# Altium project gap9_deck_v2.PrjPcb (part 1 of 2)
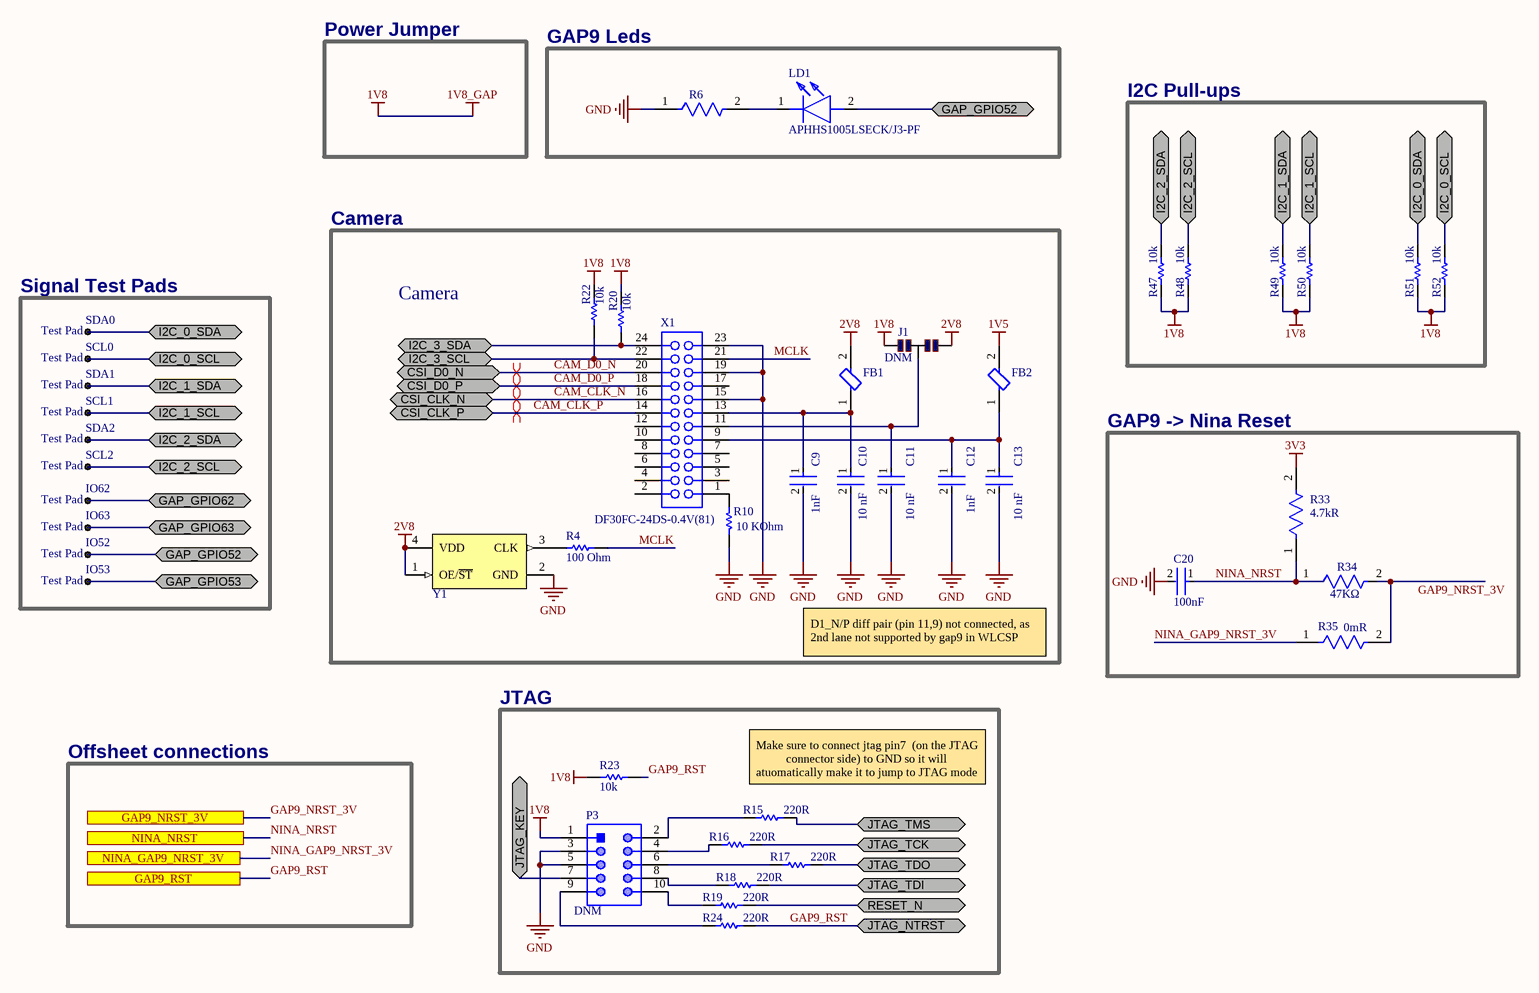
[diagram p0: 01_GAP9_INTERFACE.SchDoc]
9 sheets, 181 parts. Net scope: flat (ports and power ports of the same name join across sheets).
Board file: Crazyflie_Shield.PcbDoc
Sheets:
  01_GAP9_INTERFACE.SchDoc
  02_GAP9_CHIP_POWER.SchDoc
  03_GAP9_CHIP_JTAG_XTALs.SchDoc
  04_GAP9_CHIP_MEM.SchDoc
  05_GAP9_CHIP_GPIO.SchDoc
  06_TOFs.SchDoc
  07_NINA-WIFI.SchDoc
  08_CF_INTERFACE.SchDoc
  09_POWER.SchDoc

## Sheet 01_GAP9_INTERFACE.SchDoc: GAP9Shield
size A3; DrawnBy: Hanna Müller and Victor Kartsch; Organization: Integrated Systems Laboratory; DocumentNumber: 1; Revision: v1.0; SheetNumber: 1; SheetTotal: 9

### Parts
C9  value 1nF  [FP-GRM155-0_05-IPC_B]  (hidden comment: C0402C102F5GECAUTO)
C10  Capacitance: 10 nF  [FP-CC0402-MFG]  (hidden comment: CC0402KRX7R7BB103)
C11  Capacitance: 10 nF  [FP-CC0402-MFG]  (hidden comment: CC0402KRX7R7BB103)
C12  value 1nF  [FP-GRM155-0_05-IPC_B]  (hidden comment: C0402C102F5GECAUTO)
C13  Capacitance: 10 nF  [FP-CC0402-MFG]  (hidden comment: CC0402KRX7R7BB103)
C20  value 100nF  [FP-C1005-050-0_05-MFG]  (hidden comment: C1005X5R1E104K050BC)
FB1  BLM18HE152SN1D  [FP-BLM18-0_15-t0_8-IPC_C]  (value not drawn)
FB2  BLM18HE152SN1D  [FP-BLM18-0_15-t0_8-IPC_C]  (value not drawn)
IO52  Test Pad  [Pad-1.5mm]  (no BOM)
IO53  Test Pad  [Pad-1.5mm]  (no BOM)
IO62  Test Pad  [Pad-1.5mm]  (no BOM)
IO63  Test Pad  [Pad-1.5mm]  (no BOM)
J1  DNM  [Jumper 3 pins]  (no BOM)
LD1  APHHS1005LSECK/J3-PF  [APHHS1005LSECKJ3PF]
P3  DNM  [2x10Pin_Horizontal_50mil]
R4  value 100 Ohm  [RESC1005X40X25LL05T05]  (hidden comment: ERJ-2RKF1000X)
R6  RC0201JR-070RL  [FP-RC_L0201-MFG]  (value not drawn)
R10  value 10 KOhm  [RESC1005X40X25NL05T05]  (hidden comment: ERJ-2RKF1002X)
R15  value 220R  [RESC0603X28X15ML05T05]  (hidden comment: CRCW0201220RFKED)
R16  value 220R  [RESC0603X28X15ML05T05]  (hidden comment: CRCW0201220RFKED)
R17  value 220R  [RESC0603X28X15ML05T05]  (hidden comment: CRCW0201220RFKED)
R18  value 220R  [RESC0603X28X15ML05T05]  (hidden comment: CRCW0201220RFKED)
R19  value 220R  [RESC0603X28X15ML05T05]  (hidden comment: CRCW0201220RFKED)
R20  value 10k  [RESC0603X28X15LL05T05]  (hidden comment: CRCW020110K0FNED)
R22  value 10k  [RESC0603X28X15LL05T05]  (hidden comment: CRCW020110K0FNED)
R23  value 10k  [RESC0603X28X15LL05T05]  (hidden comment: CRCW020110K0FNED)
R24  value 220R  [RESC0603X28X15ML05T05]  (hidden comment: CRCW0201220RFKED)
R33  value 4.7kR  [FP-CRCW0402-e3-IPC_B]  (hidden comment: CRCW04024K70FKED)
R34  value 47KΩ  [FP-CRGCQ0402-IPC_C]  (hidden comment: CRGCQ0402F47K)
R35  value 0mR  [FP-CRCW0402-e3-IPC_C]  (hidden comment: CRCW04020000Z0ED)
R47  value 10k  [RESC0603X28X15LL05T05]  (hidden comment: CRCW020110K0FNED)
R48  value 10k  [RESC0603X28X15LL05T05]  (hidden comment: CRCW020110K0FNED)
R49  value 10k  [RESC0603X28X15LL05T05]  (hidden comment: CRCW020110K0FNED)
R50  value 10k  [RESC0603X28X15LL05T05]  (hidden comment: CRCW020110K0FNED)
R51  value 10k  [RESC0603X28X15LL05T05]  (hidden comment: CRCW020110K0FNED)
R52  value 10k  [RESC0603X28X15LL05T05]  (hidden comment: CRCW020110K0FNED)
SCL0  Test Pad  [Pad-1.5mm]  (no BOM)
SCL1  Test Pad  [Pad-1.5mm]  (no BOM)
SCL2  Test Pad  [Pad-1.5mm]  (no BOM)
SDA0  Test Pad  [Pad-1.5mm]  (no BOM)
SDA1  Test Pad  [Pad-1.5mm]  (no BOM)
SDA2  Test Pad  [Pad-1.5mm]  (no BOM)
X1  DF30FC-24DS-0.4V(81)  [DF30FC-24DS-0.4V(81)]
Y1  KC2520K25.0000C1GE00  [AB-24.000MAGE-T]  (value not drawn)

### Blocks framed on the sheet
GAP9 Leds: LD1 R6
I2C Pull-ups: R47-R52
Signal Test Pads: IO52 IO53 IO62 IO63 SCL0-SCL2 SDA0-SDA2
GAP9 -> Nina Reset: C20 R33-R35
JTAG: P3 R15-R19 R23 R24

### Ports
CSI_CLK_N (bidir), CSI_CLK_P (bidir), CSI_D0_N (bidir), CSI_D0_P (bidir), GAP9_NRST_3V, GAP9_RST, GAP_GPIO52 (bidir), GAP_GPIO53 (bidir), GAP_GPIO62 (bidir), GAP_GPIO63 (bidir), I2C_0_SCL (bidir), I2C_0_SDA (bidir), I2C_1_SCL (bidir), I2C_1_SDA (bidir), I2C_2_SCL (bidir), I2C_2_SDA (bidir), I2C_3_SCL (bidir), I2C_3_SDA (bidir), JTAG_KEY (bidir), JTAG_NTRST (bidir), JTAG_TCK (bidir), JTAG_TDI (bidir), JTAG_TDO (bidir), JTAG_TMS (bidir), NINA_GAP9_NRST_3V, NINA_NRST, RESET_N (bidir)

### Nets
1V5: FB2.2
1V8: J1.1 P3.1 R20.2 R22.2 R23.1 R47.1 R48.1 R49.1 R50.1 R51.1 R52.1  [also labelled 1V8_GAP]
2V8: FB1.2 J1.3 Y1.1(OE/~{ST}) Y1.4(VDD)
3V3: R33.2
GND: C9.2 C10.2 C11.2 C12.2 C13.2 C20.2 P3.3 P3.5 R6.1 R10.2 X1.15 X1.19 X1.23 Y1.2(GND)
CAM_CLK_N: X1.16 ; port CSI_CLK_N
CAM_CLK_P: X1.14 ; port CSI_CLK_P
CAM_D0_N: X1.20 ; port CSI_D0_N
CAM_D0_P: X1.18 ; port CSI_D0_P
GAP9_NRST_3V: R34.2 R35.2 ; port GAP9_NRST_3V
GAP9_RST: R23.2 R24.2 ; port JTAG_NTRST, port GAP9_RST
GAP_GPIO52: IO52.1 LD1.2(A) ; port GAP_GPIO52
GAP_GPIO53: IO53.1 ; port GAP_GPIO53
GAP_GPIO62: IO62.1 ; port GAP_GPIO62
GAP_GPIO63: IO63.1 ; port GAP_GPIO63
I2C_0_SCL: R52.2 SCL0.1 ; port I2C_0_SCL
I2C_0_SDA: R51.2 SDA0.1 ; port I2C_0_SDA
I2C_1_SCL: R50.2 SCL1.1 ; port I2C_1_SCL
I2C_1_SDA: R49.2 SDA1.1 ; port I2C_1_SDA
I2C_2_SCL: R48.2 SCL2.1 ; port I2C_2_SCL
I2C_2_SDA: R47.2 SDA2.1 ; port I2C_2_SDA
I2C_3_SCL: R22.1 X1.22 ; port I2C_3_SCL
I2C_3_SDA: R20.1 X1.24 ; port I2C_3_SDA
JTAG_TCK: R16.2 ; port JTAG_TCK
JTAG_TDI: R18.2 ; port JTAG_TDI
JTAG_TDO: R17.2 ; port JTAG_TDO
JTAG_TMS: R15.2 ; port JTAG_TMS
MCLK: R4.1 X1.21
NINA_GAP9_NRST_3V: R35.1 ; port NINA_GAP9_NRST_3V
NINA_NRST: C20.1 R33.1 R34.1 ; port NINA_NRST
RESET_N: R19.2 ; port RESET_N
NetC9_1: C9.1 C10.1 FB1.1 X1.13
NetC11_1: C11.1 J1.2 X1.11
NetC12_1: C12.1 C13.1 FB2.1 X1.9
NetLD1_1: LD1.1(K) R6.2
NetP3_2: P3.2 R15.1
NetP3_4: P3.4 R16.1
NetP3_6: P3.6 R17.1
NetP3_7: P3.7 ; port JTAG_KEY
NetP3_8: P3.8 R18.1
NetP3_9: P3.9 R24.1
NetP3_10: P3.10 R19.1
NetR4_2: R4.2 Y1.3(CLK)
NetR10_1: R10.1 X1.1

Not connected (* = marked no-connect by the designer): X1 2 3 4 5 6 7 8 10 12 17

### Layout directives
differential pair: CAM_CLK_N, CAM_CLK_P, CAM_D0_N, CAM_D0_P

### Notes on the sheet
- Power Jumper
- Camera
- D1_N/P diff pair (pin 11,9) not connected, as 2nd lane not supported by gap9 in WLCSP
- Offsheet connections
- (near R15) Make sure to connect jtag pin7  (on the JTAG connector side) to GND so it will atuomatically make it to jump to JTAG mode
- 1
- 2
- 3
- 4
- 5
- 6
- 7
- 8
- A
- B
- C
- D
- Project:
- Date:
- Drawing number:
- Rev:
- Format:
- A3
- Drawn by:
- Laboratory:
- Page
- Sheet:
- of
- File:

### Library data of the parts
C9 C12 = CMP-2008-04254-2: Chip Multilayer Ceramic Capacitors for General Purpose, 0402, 1000pF, C0G, 30ppm/°C, 5%, 50V; Insulation Resistance: 10GR; Packaging: Tape and Reel; Lead Free: Lead Free; Tolerance: 5%; Temperature Coefficient: 30ppm/°C; Thickness: 0.022inch; Termination: SMD/SMT; Max Operating Temperature: 125°C; Height: 0.5mm; Package Quantity: 1; Radiation Hardening: No; Material: Ceramic; Case Code (Metric): 1005; Number of Pins: 2; Voltage Rating: 50V; Mount: Surface Mount; Voltage: 50V; Case/Package: 0402; Min Operating Temperature: -55°C; Dielectric Material: Ceramic; Width: 0.5mm; Depth: 0.5mm; Case Code (Imperial): 0402; REACH SVHC: No SVHC; Dielectric: C0G; Capacitance: 1nF; Voltage Rating (DC): 50V; Length: 1mm
C10 C11 C13 = CMP-03422-000501-1: CAP CER 10000PF 16V X7R 0402; Manufacturer: YAGEO; Automotive Grade: NA; Material: Ceramic; Value: 10 nF; Tolerance: 0.1; Temperature Coefficient: 30ppm/°C; Temperature Range Low: -55°C; Temperature Range High: +125°C; Mouser Description: 0402 10 nF 16 V ±10 % Tolerance X7R SMT Multilayer Ceramic Capacitor; Footprint Url: http://www.yageo.com/exep/pages/download/literatures/UPY-C_GEN_24.pdf; Category: Cap; RoHS: TRUE; Manufacturer Part Number: CC0402KRX7R7BB103; ComponentLink2Description: Datasheet; Ipc Land Pattern Name: CAPC10050X50; Automotive: No; ComponentLink2URL: http://www.yageo.com/documents/recent/UPY-GP_NP0_16V-to-50V_16.pdf; Device Class L1: Passive Components; Height: 0.55mm; Temperature Characteristic: X7R; Package: CC0402; Voltage Rating: 16 V; Device Class L3: Ceramic Capacitors; Lead Free: Yes; Device Class L2: Capacitors; Digikey Description: CAP CER 10000PF 16V X7R 0402; Octopart: https://octopart.com/cc0402krx7r7bb103-yageo-192895; Temperature: -55°C to +125°C
C20 = CMP-2000-06000-2: Multilayer Ceramic Capacitors 100nF ±10% 25V X5R SMD 0402; Case Code (Imperial): 0402; Termination: Wraparound; Series: C; Depth: 0.5mm; Voltage Rating (DC): 25V; Contact Plating: Tin; Case Code (Metric): 1005; Dielectric: X5R; Case/Package: 0402; Voltage Rating: 25V; Packaging: Tape and Reel; Thickness: 0.022inch; Dielectric Material: Ceramic; Height: 0.5mm; Weight: 2.3E-05oz; RoHS Compliant: Yes; Width: 0.02inch; Capacitance: 100nF; Tolerance: 10%; Mount: Surface Mount; Package Quantity: 1; Max Operating Temperature: 85°C; Construction: Flat; Min Operating Temperature: -55°C; REACH SVHC: No SVHC; Resistor Type: Ceramic; Length: 1mm; Lead Free: Lead Free; Voltage: 25V
FB1 FB2 = CMP-0686-00368-3: Chip Ferrite Bead, 0603, 1500Ω @ 100MHz, 0.5Ω, 25%, 500mA; Impedance: 1.5kR; DC Resistance (DCR): 500mR; Number of Circuits: 1; value: 1.5 kOhms; Test Frequency: 100MHz; Case/Package: 0603; Max Operating Temperature: 125°C; Package Quantity: 1; Max DC Current: 500mA; Tolerance: 25%; Core Material: Ferrite; Width: 0.8mm; Number of Pins: 2; Depth: 0.8mm; Radiation Hardening: No; Case Code (Imperial): 0603; Min Operating Temperature: -55°C; Termination: SMD/SMT; Material: Ferrite; Military Standard: Not; Number of Lines: 1; DC Current: 500mA; Length: 1.6mm; REACH SVHC: No SVHC; Lead Free: Lead Free; Current Rating: 500mA; Max Current Rating: 500mA; Packaging: Tape and Reel; Case Code (Metric): 1608; Height: 0.8mm
IO52 IO53 IO62 IO63 SCL0-SCL2 SDA0-SDA2 = CMP-01283-1: 1mm SMT Test Pad; Mounting Technology: SMT
J1 = CMP-00467-5: Solder Jumper 3 Pads; Technology: SMT
LD1 = APHHS1005LSECK_J3-PF: LED; Manufacturer_Name: Kingbright; Datasheet Link: https://www.mouser.com/datasheet/2/216/APHHS1005LSECK-J3-PF-1660327.pdf; Manufacturer_Part_Number: APHHS1005LSECK/J3-PF; Mouser Part Number: 604-APHHS1005LSECKJ3; Mouser Price/Stock: https://www.mouser.co.uk/ProductDetail/Kingbright/APHHS1005LSECK-J3-PF?qs=WbpYJYa8y3339Udm5EE3iA%3D%3D; Arrow Part Number: APHHS1005LSECK/J3-PF; Arrow Price/Stock: https://www.arrow.com/en/products/aphhs1005lseckj3-pf/kingbright?region=nac
P3 = CF_JTAG_Header: 2x10 Pin 50mil Header; Supplier 1: Digi-Key; Supplier Part Number 1: 732-5374-ND
R4 = CMP-2002-00605-3: Chip Resistor, 100 Ohm, +/- 1%, 100 mW, -55 to 155 degC, 0402 (1005 Metric), RoHS, Tape and Reel; Manufacturer: Basic Passives; Power Rating: 100 mW; Voltage Rating: 50 V; Case\/Package: 0402; Width: 0.5 mm; Pins: 2; ComponentLink2Description: Datasheet; PackageReference: 0402; Height: 0.35 mm; Tolerance: 1%; DatasheetVersion: 04/2015; Case Code (Imperial): 0402; Min Operating Temperature: -55 degC; Radiation Hardening: No; Length: 1 mm; Package Quantity: 10000; PackageDescription: 2-Pin Surface Mount Device, Body 1 x 0.5 mm; Mounting Technology: Surface Mount; Case Code (Metric): 1005; Packaging: Tape and Reel; ComponentLink1URL: http://www.panasonic.com/; RoHSCompliant: true; Max Operating Temperature: 155 degC; REACH SVHC: Yes; PartNumber: ERJ-2RKF1000X; ComponentLink1Description: Manufacturer URL; Resistance: 100 Ohm; ComponentLink2URL: http://industrial.panasonic.com/cdbs/www-data/pdf/RDA0000/AOA0000C86.pdf; Mount: Surface Mount
R6 = CMP-03412-023265-1: RES SMD 0 OHM JUMPER 1/20W 0201; Manufacturer: Yageo; Power Rating: 50mW; Value: 0Ω; Temperature Coefficient: 200ppm/°C; Voltage Rating: 25V; Tolerance: 5%; Octopart: https://octopart.com/rc0201jr-070rl-yageo-43171986; ComponentLink2URL: http://www.yageo.com/documents/recent/PYu-RC_Group_51_RoHS_L_10.pdf; Device Class L2: Resistors; Series: RC_L; Ipc Land Pattern Name: RESC6030X23; Temperature: -55°C to +125°C; Mouser Description: Thick Film Resistors ZERO OHM JUMPER; Footprint Url: http://www.yageo.com/exep/pages/download/literatures/PYu-R_Mount_10.pdf; RoHS: TRUE; Package: RC_L0201; Device Class L3: Chip SMD Resistors; Temperature Range Low: -55°C; Composition: Thick Film; ComponentLink2Description: Datasheet; Height: 0.26mm; Device Class L1: Passive Components; Category: Res; Resistance: 0Ω; Manufacturer Part Number: RC0201JR-070RL; Temperature Range High: +125°C; Automotive: No; Lead Free: Yes; Digikey Description: RES SMD 0 OHM JUMPER 1/20W 0201
R10 = CMP-2002-00607-3: Chip Resistor, 10 KOhm, +/- 1%, 100 mW, -55 to 155 degC, 0402 (1005 Metric), RoHS, Tape and Reel; Manufacturer: Basic Passives; Case\/Package: 0402; Voltage Rating: 50 V; Power Rating: 100 mW; Packaging: Tape and Reel; Width: 0.5 mm; Package Quantity: 10000; Radiation Hardening: No; Min Operating Temperature: -55 degC; Case Code (Imperial): 0402; REACH SVHC: Yes; PackageDescription: 2-Pin Surface Mount Device, Body 1 x 0.5 mm; Length: 1 mm; ComponentLink1Description: Manufacturer URL; PackageReference: 0402; RoHSCompliant: true; Resistance: 10 KOhm; ComponentLink1URL: http://www.panasonic.com/; Height: 0.35 mm; ComponentLink2Description: Datasheet; DatasheetVersion: 04/2015; Mounting Technology: Surface Mount; ComponentLink2URL: http://industrial.panasonic.com/cdbs/www-data/pdf/RDA0000/AOA0000C86.pdf; Max Operating Temperature: 155 degC; Pins: 2; Tolerance: 1%; PartNumber: ERJ-2RKF1002X; Case Code (Metric): 1005; Mount: Surface Mount
R15-R19 R24 = CMP-2004-00982-1: Manufacturer: Vishay Dale; Part Number: CRCW0201220RFKED
R20 R22 R23 R47-R52 = CMP-2004-00016-1: Manufacturer: Vishay Dale; Part Number: CRCW020110K0FNED
R33 = CMP-2002-00051-3: RES Thick Film, 4.7kΩ, 1%, 0.063W, 100ppm/°C, 0402; Voltage Rating (DC): 50V; Power Rating: 63mW; Termination: SMD/SMT; Military Standard: Not; Length: 1mm; Radiation Hardening: No; Max Operating Temperature: 155°C; Min Operating Temperature: -55°C; Package Quantity: 10; Width: 0.5mm; Case Code (Imperial): 0402; Number of Terminations: 2; Max Power Dissipation: 63mW; Tolerance: 1%; Features: Automotive AEC-Q200; Composition: Thick Film; Depth: 0.5mm; Mount: Surface Mount; Weight: 2.3E-05oz; Lead Free: Lead Free; Case/Package: 0402; Height: 0.35mm; Packaging: Tape and Reel; Temperature Coefficient: 100ppm/°C; Case Code (Metric): 1005; Voltage Rating: 50V; Contact Plating: Tin; Resistance: 4.7kR
R34 = CMP-03211-001552-1: CRGCQ0402 47KΩ 1% ±100ppm/°C 50V; Manufacturer: TE Connectivity; Power Rating: 0.0625W; Tolerance: 0.01; Lead Free: Yes; Temperature Range Low: -55°C; Composition: Thick Film; Temperature Range High: +155°C; Octopart: https://octopart.com/crgcq0402f47k-te+connectivity-91017973; Ipc Land Pattern Name: RESC10050X35; Series: CRGCQ; Device Class L2: Resistors; Temperature: -55°C to +155°C; ComponentLink2URL: https://www.te.com/commerce/DocumentDelivery/DDEController?Action=showdoc&DocId=Data+Sheet%7F1773204-3%7F1%7Fpdf%7FEnglish%7FENG_DS_1773204-3_1.pdf%7F4-2176347-1074; RoHS: TRUE; Package: CRGCQ0402; Voltage Rating: 50V; Resistance: 47KΩ; Temperature Coefficient: ±100ppm/°C; Ambient Temperature Range High: +70°C; Category: Res; Height: 0.4mm; Device Class L1: Passive Components; Manufacturer Part Number: CRGCQ0402F47K; Device Class L3: Chip SMD Resistors; ComponentLink2Description: Datasheet; Automotive: Yes
R35 = CMP-2002-08122-2: RES Thick Film, 0Ω, 0.063W, 0402; Tolerance: 5%; Max Power Dissipation: 63mW; Voltage Rating: 50V; Temperature Coefficient: 100ppm/°C; Contact Plating: Tin; Height: 0.35mm; Radiation Hardening: No; Features: Automotive AEC-Q200; Composition: Thick Film; Width: 0.5mm; Weight: 2.3E-05oz; Termination: SMD/SMT; Packaging: Tape and Reel; Mount: Surface Mount; Case Code (Metric): 1005; Military Standard: Not; Min Operating Temperature: -55°C; Number of Terminations: 2; Package Quantity: 1; Case Code (Imperial): 0402; Depth: 0.5mm; Max Operating Temperature: 155°C; Case/Package: 0402; Resistance: 0mR; Power Rating: 63mW; Lead Free: Lead Free; Voltage Rating (DC): 50V; Length: 1mm
X1 = CMP-02115-1: Board Connector, 24 Contact(s), 2 Row(s), Female, Straight, 0.016 inch Pitch, Surface Mount Terminal, Locking, Black Insulator, Receptacle; MIL Conformance: No; Insulation Resistance: 50MR; Durability: 50Cycles; Mating Information: MULTIPLE MATING PARTS AVAILABLE; Rated Current (Signal): 300mA; PCB Contact Pattern: RECTANGULAR; Contact Resistance: 100mR; Body Breadth: 0.18inch; PCB Contact Row Spacing: 4.1656mm; Reference Standard: UL; Reliability: COMMERCIAL; Number Of Connectors: 1; Additional Feature: Low Profile; Number of Rows Loaded: 2; Body Depth: 0.035inch; Number of Contacts: 24; Option: General Purpose; Body Length: 0.234inch; Dielectric Withstanding Voltage (AC): 100V; Termination: SMD/SMT; Mounting Style: STRAIGHT; Contact Finish - Termination: GOLD; Mount: Board; Contact Gender: Female; DIN Conformance: No; Body/Shell Style: RECEPTACLE; Max Operating Temperature: 85°C; Insulation Material: Polymer; Insulation Color: Black; Mixed Contacts: No; Contact Pattern: RECTANGULAR; Connector Type: BOARD CONNECTOR; Contact Finish - Mating: GOLD; Mating Contact Pitch: 0.016inch; RoHS Compliant: Yes; Terminal Pitch: 0.4mm; Mounting Option 1: LOCKING; REACH SVHC: No SVHC; IEC Conformance: No; Flammability Rating: UL94 V-0; JESD-609 Code: e4; Contact Material: Bronze; Filter Feature: No; Number Of PCB Rows: 2; Min Operating Temperature: -35°C
Y1 = SiT8008: OSCILLATOR XO 25.000MHZ CMOS SMD; Manufacturer: AVX-Corp-Kyocera-Corp; Frequency: 25MHz; Function: Standby (Power Down); Voltage - Supply: 1.8V, 2.5V, 3.3V; Frequency Stability: ±50ppm; Current - Supply (Max): 3.5mA; Current - Supply (Disable) (Max): 10µA; Category: Crystals and Oscillators; Family: Oscillators; Series: KC2520B-C1, Kyocera; Packaging: Tape &amp; Reel (TR); Type: XO (Standard); ComponentLink1Description: kc2520b_c1_e-514106.pdf; ComponentLink1URL: http://www.mouser.com/ds/2/40/kc2520b_c1_e-514106.pdf; ComponentLink2Description: 0323_03086292; ComponentLink2URL: http://components.arrow.com/part/dataview/0323_03086292; Output: CMOS; Operating Temperature: -40°C ~ 85°C; Ratings: -; Mounting Type: Surface Mount; Size / Dimension: 0.098" L x 0.079" W (2.50mm x 2.00mm); Height: 0.028" (0.70mm); Package / Case: 4-SMD, No Lead (DFN, LCC); Manufacturer Part Number: KC2520K25.0000C1GE00; Supplier: Digikey; Supplier Part Number: 1253-1237-2-ND

## Sheet 02_GAP9_CHIP_POWER.SchDoc: GAP9Shield
size A3; DrawnBy: Hanna Müller and Victor Kartsch; Organization: Integrated Systems Laboratory; DocumentNumber: 2; Revision: v1.0; SheetNumber: 2; SheetTotal: 9
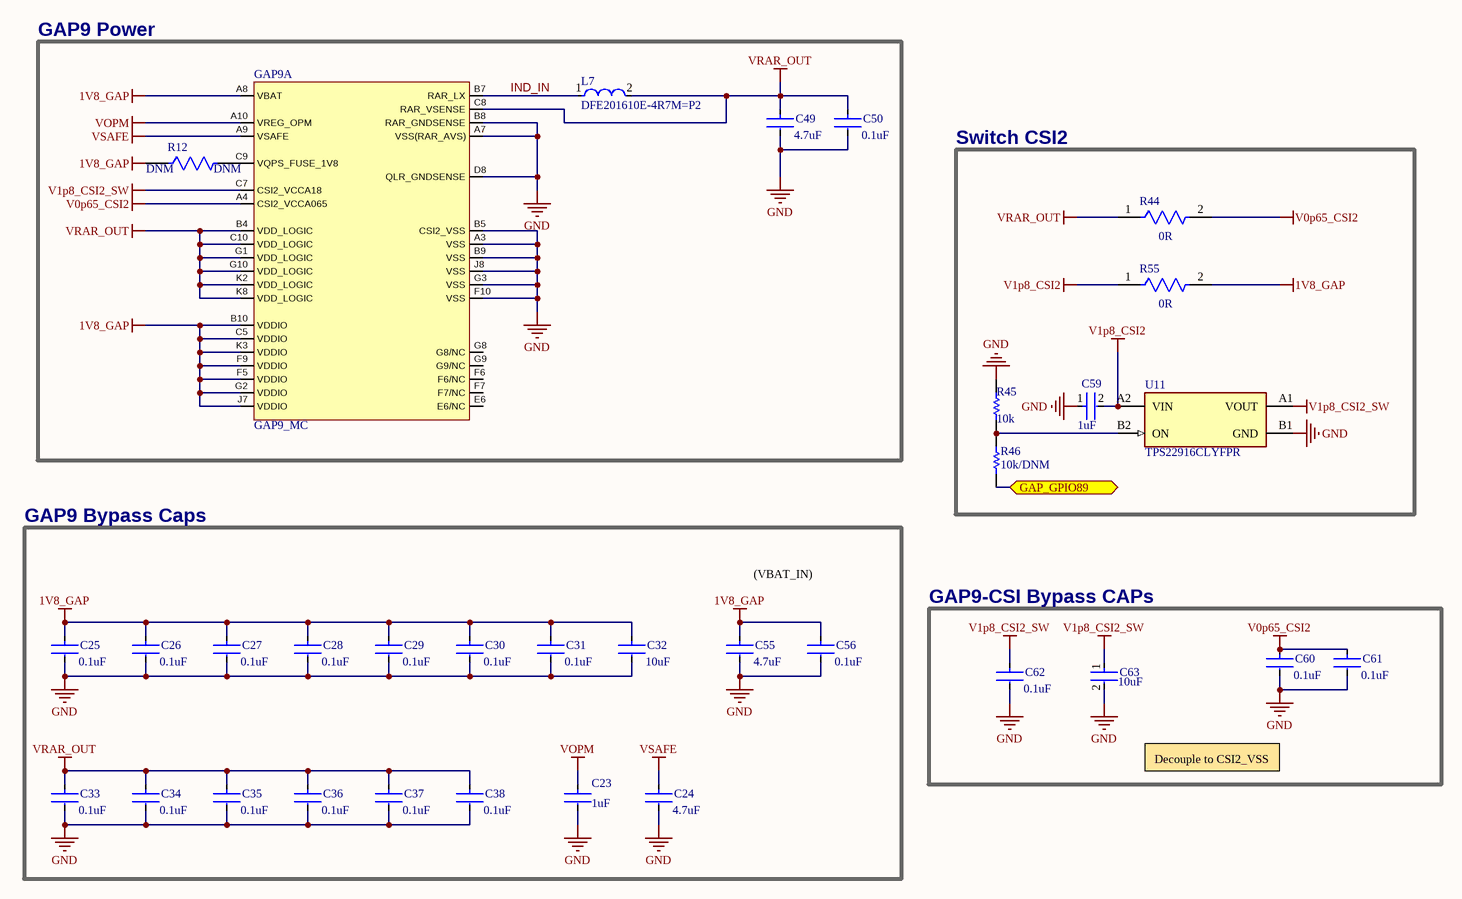
[diagram p1: 02_GAP9_CHIP_POWER.SchDoc]

### Parts
C23  Capacitance: 1uF  [FP-CL03-IPC_B]  (hidden comment: CL03A105KP3NSNC)
C24  Capacitance: 4.7uF  [FP-C1005-050-0_15-IPC_B]  (hidden comment: C1005X5R0J475K050BC)
C25  Capacitance: 0.1uF  [FP-GRM033-0_03-IPC_B]  (hidden comment: GRM033Z71C104KE14D)
C26  Capacitance: 0.1uF  [FP-GRM033-0_03-IPC_B]  (hidden comment: GRM033Z71C104KE14D)
C27  Capacitance: 0.1uF  [FP-GRM033-0_03-IPC_B]  (hidden comment: GRM033Z71C104KE14D)
C28  Capacitance: 0.1uF  [FP-GRM033-0_03-IPC_B]  (hidden comment: GRM033Z71C104KE14D)
C29  Capacitance: 0.1uF  [FP-GRM033-0_03-IPC_B]  (hidden comment: GRM033Z71C104KE14D)
C30  Capacitance: 0.1uF  [FP-GRM033-0_03-IPC_B]  (hidden comment: GRM033Z71C104KE14D)
C31  Capacitance: 0.1uF  [FP-GRM033-0_03-IPC_B]  (hidden comment: GRM033Z71C104KE14D)
C32  Capacitance: 10uF  [FP-CL05A106MP5NUNC-IPC_B]  (hidden comment: CL05A106MP5NUNC)
C33  Capacitance: 0.1uF  [FP-GRM033-0_03-IPC_B]  (hidden comment: GRM033Z71C104KE14D)
C34  Capacitance: 0.1uF  [FP-GRM033-0_03-IPC_B]  (hidden comment: GRM033Z71C104KE14D)
C35  Capacitance: 0.1uF  [FP-GRM033-0_03-IPC_B]  (hidden comment: GRM033Z71C104KE14D)
C36  Capacitance: 0.1uF  [FP-GRM033-0_03-IPC_B]  (hidden comment: GRM033Z71C104KE14D)
C37  Capacitance: 0.1uF  [FP-GRM033-0_03-IPC_B]  (hidden comment: GRM033Z71C104KE14D)
C38  Capacitance: 0.1uF  [FP-GRM033-0_03-IPC_B]  (hidden comment: GRM033Z71C104KE14D)
C49  Capacitance: 4.7uF  [FP-C1005-050-0_15-IPC_B]  (hidden comment: C1005X5R0J475K050BC)
C50  Capacitance: 0.1uF  [FP-GRM033-0_03-IPC_B]  (hidden comment: GRM033Z71C104KE14D)
C55  Capacitance: 4.7uF  [FP-C1005-050-0_15-IPC_B]  (hidden comment: C1005X5R0J475K050BC)
C56  Capacitance: 0.1uF  [FP-GRM033-0_03-IPC_B]  (hidden comment: GRM033Z71C104KE14D)
C59  value 1uF  [FP-GRM033-0_09-IPC_C]  (hidden comment: GRM033C81A105ME05D)
C60  Capacitance: 0.1uF  [FP-GRM033-0_03-IPC_B]  (hidden comment: GRM033Z71C104KE14D)
C61  Capacitance: 0.1uF  [FP-GRM033-0_03-IPC_B]  (hidden comment: GRM033Z71C104KE14D)
C62  Capacitance: 0.1uF  [FP-GRM033-0_03-IPC_B]  (hidden comment: GRM033Z71C104KE14D)
C63  value 10uF  [FP-CL05A106MP5NUNC-MFG]  (hidden comment: CL05A106MP5NUNC)
GAP9  GAP9_MC  [GAP9]  (part A of 5)
L7  DFE201610E-4R7M=P2  [FP-DFE201610C-MFG]
R12  DNM  [0402]
R44  value 0R  [FP-CRCW0402-C-e3-MFG]  (hidden comment: CRCW04020000Z0EDC)
R45  value 10k  [RESC0603X28X15LL05T05]  (hidden comment: CRCW020110K0FNED)
R46  value 10k/DNM  [RESC0603X28X15LL05T05]  (hidden comment: CRCW020110K0FNED)
R55  value 0R  [FP-CRCW0402-C-e3-MFG]  (hidden comment: CRCW04020000Z0EDC)
U11  TPS22916CLYFPR  [FP-YFP0004-IPC_C]

### Blocks framed on the sheet
GAP9 Power: C49 C50 GAP9 L7 R12
Switch CSI2: C59 R44-R46 R55 U11
GAP9 Bypass Caps: C23-C38 C55 C56
GAP9-CSI Bypass CAPs: C60-C63

### Ports
GAP_GPIO89 (bidir)

### Nets
1V8_GAP: C25.1 C26.1 C27.1 C28.1 C29.1 C30.1 C31.1 C32.1 C55.1 C56.1 GAP9.A8(VBAT) GAP9.B10(VDDIO) GAP9.C5(VDDIO) GAP9.F5(VDDIO) GAP9.F9(VDDIO) GAP9.G2(VDDIO) GAP9.J7(VDDIO) GAP9.K3(VDDIO) R12.1 R55.2  [project net 1V8]
GND: C23.2 C24.2 C25.2 C26.2 C27.2 C28.2 C29.2 C30.2 C31.2 C32.2 C33.2 C34.2 C35.2 C36.2 C37.2 C38.2 C49.2 C50.2 C55.2 C56.2 C59.1 C60.2 C61.2 C62.2 C63.2 GAP9.A3(VSS) GAP9.A7(VSS(RAR_AVS)) GAP9.B5(CSI2_VSS) GAP9.B8(RAR_GNDSENSE) GAP9.B9(VSS) GAP9.D8(QLR_GNDSENSE) GAP9.F10(VSS) GAP9.G3(VSS) GAP9.J8(VSS) R45.2 U11.B1(GND)
V0p65_CSI2: C60.1 C61.1 GAP9.A4(CSI2_VCCA065) R44.2
V1p8_CSI2: C59.2 R55.1 U11.A2(VIN)
V1p8_CSI2_SW: C62.1 C63.1 GAP9.C7(CSI2_VCCA18) U11.A1(VOUT)
VOPM: C23.1 GAP9.A10(VREG_OPM)
VRAR_OUT: C33.1 C34.1 C35.1 C36.1 C37.1 C38.1 C49.1 C50.1 GAP9.B4(VDD_LOGIC) GAP9.C8(RAR_VSENSE) GAP9.C10(VDD_LOGIC) GAP9.G1(VDD_LOGIC) GAP9.G10(VDD_LOGIC) GAP9.K2(VDD_LOGIC) GAP9.K8(VDD_LOGIC) L7.2 R44.1
VSAFE: C24.1 GAP9.A9(VSAFE)
GAP_GPIO89: R46.2 ; port GAP_GPIO89
IND_IN: GAP9.B7(RAR_LX) L7.1
NetGAP9_C9: GAP9.C9(VQPS_FUSE_1V8) R12.2
NetR45_1: R45.1 R46.1 U11.B2(ON)

Not connected (* = marked no-connect by the designer): GAP9 E6(E6/NC) F6(F6/NC) F7(F7/NC) G8(G8/NC) G9(G9/NC)

### Notes on the sheet
- (VBAT_IN)
- Decouple to CSI2_VSS
- 1
- 2
- 3
- 4
- 5
- 6
- 7
- 8
- A
- B
- C
- D
- Project:
- Date:
- Drawing number:
- Rev:
- Format:
- A3
- Drawn by:
- Laboratory:
- Page
- Sheet:
- of
- File:

### Library data of the parts
C23 = CMP-13271-003594-1: Cap Ceramic 1uF 10V X5R ±10% Pad SMD 0201 +85°C T/R; Min Operating Temperature: -55°C; Mount: Surface Mount; Packaging: Cut Tape; Width: 0.012inch; Tolerance: 10%; Case Code (Imperial): 0201; Thickness: 0.013inch; Length: 0.024inch; Case/Package: 0201; Max Operating Temperature: 85°C; Voltage Rating: 10V; Case Code (Metric): 0603; value: 1uF
C24 C49 C55 = CMP-2000-05437-2: Chip Multilayer Ceramic Capacitors for General Purpose, 0402, 4.7uF; Voltage: 6.3V; Tolerance: 10%; Dielectric: X5R; Depth: 0.5mm; Height: 0.5mm; Dielectric Material: Ceramic; Length: 1mm; Termination: SMD/SMT; RoHS Compliant: Yes; Series: C; Case/Package: 0402; Lead Free: Lead Free; Mount: Surface Mount; Max Operating Temperature: 85°C; Min Operating Temperature: -55°C; value: 4.7uF
C25-C31 C33-C38 C50 C56 C60-C62 = CMP-06035-035508-1: Chip Multilayer Ceramic Capacitors for General Purpose, 0201, 0.10uF, X7R, 15%, 10%, 16V; value: 0.1uF; Case/Package: 0201
C32 C63 = CMP-13271-000002-1: CAP CER 10UF 10V X5R 0402; Manufacturer: Samsung; Temperature Coefficient: 15%; Tolerance: 20%; Material: Ceramic; Octopart: https://octopart.com/cl05a106mp5nunc-samsung-22457395; Voltage Rating: 10V; RoHS: TRUE; Height: 0.7mm; Digikey Description: CAP CER 10UF 10V X5R 0402; Automotive: No; Package: CL05A106MP5NUNC; Device Class L1: Passive Components; Temperature Range High: +85°C; ComponentLink2Description: Datasheet; Device Class L2: Capacitors; Temperature Characteristic: X5R; Manufacturer Part Number: CL05A106MP5NUNC; Temperature: -55°C to +85°C; ComponentLink2URL: http://www.samsungsem.com/kr/support/product-search/mlcc/__icsFiles/afieldfile/2019/05/10/19-CL05A106MP5NUNC.pdf; Device Class L3: Ceramic Capacitors; Category: Cap; Temperature Range Low: -55°C; Ipc Land Pattern Name: CAPC10050X50; Lead Free: Yes
  C32: Value: 10uF
  C63: Capacitance: 10uF
C59 = CMP-06035-000112-2: Chip Multilayer Ceramic Capacitors for General Purpose, 0201, 1.0uF, X6S, 22%, 20%, 10V; Length: 0.024inch; Case Code (Metric): 0603; Voltage Rating (DC): 10V; Packaging: Tape and Reel; Mount: Surface Mount; Voltage Rating: 10V; Dielectric: X6S; Width: 0.012inch; Min Operating Temperature: -55°C; Case/Package: 0201; Case Code (Imperial): 0201; Tolerance: 20%; Thickness: 0.015inch; Max Operating Temperature: 105°C; Capacitance: 1uF
L7 = CMP-06042-006199-1: Shielded Wirewound Inductor 4.7uH 20% 1100mA 0.288Ω 0806 (2016); value: 4.7 uH
R12 = RES DNM 0402: Resistor; Value: DNM
R44 R55 = CMP-02407-011555-1: RES 0 OHM JUMPER 1/16W 0402; Power Rating: 62.5mW; Min Operating Temperature: -55°C; RoHS Compliant: Yes; Length: 1mm; Lead Free: Lead Free; Resistor Type: Thick Film; Case/Package: Molded; Contact Plating: Tin; Resistance: 0R; Mount: Surface Mount; Max Operating Temperature: 155°C; Termination: Wraparound
R45 R46 = CMP-2004-00016-1: Manufacturer: Vishay Dale; Part Number: CRCW020110K0FNED
U11 = CMP-04910-000140-1: IC PWR SWITCH P-CHAN 1:1 4DSBGA; Output Configuration: High Side; Fault Protection: Reverse Current; Number of Outputs: 1; Max Output Current: 2A; Packaging: Tape and Reel; RoHS Compliant: Yes; Min Operating Temperature: -40°C; Number of Channels: 1; Max Operating Temperature: 85°C

## Sheet 03_GAP9_CHIP_JTAG_XTALs.SchDoc: GAP9Shield
size A3; DrawnBy: Hanna Müller and Victor Kartsch; Organization: Integrated Systems Laboratory; DocumentNumber: 3; Revision: v1.0; SheetNumber: 3; SheetTotal: 9
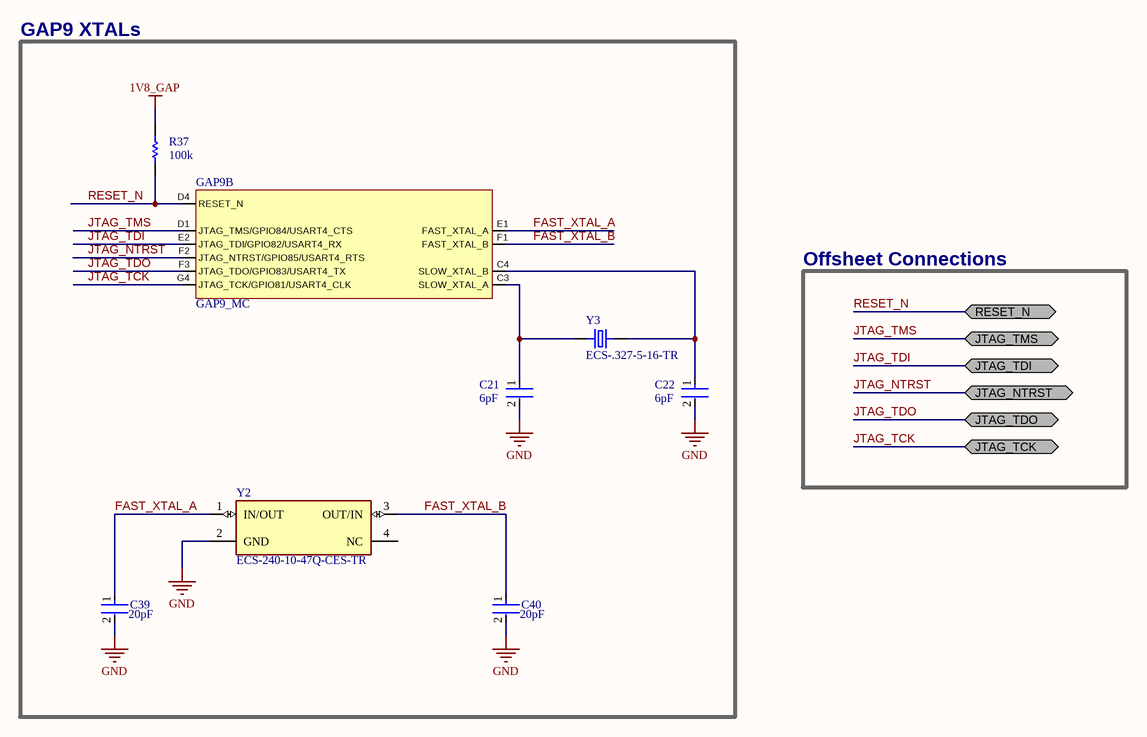
[diagram p2: 03_GAP9_CHIP_JTAG_XTALs.SchDoc]

### Parts
C21  value 6pF  [FP-GJM033-0_03-IPC_A]  (hidden comment: GJM0335G2A6R0WB01D)
C22  value 6pF  [FP-GJM033-0_03-IPC_A]  (hidden comment: GJM0335G2A6R0WB01D)
C39  value 20pF  [CAPC6333_33N_KEM-L]  (hidden comment: CBR02C200F5GAC)
C40  value 20pF  [CAPC6333_33N_KEM-L]  (hidden comment: CBR02C200F5GAC)
GAP9  GAP9_MC  [GAP9]  (part B of 5)
R37  Resistance: 100k  [RESC0201(0603)_N]  (hidden comment: ERJ-1GNF1003C)
Y2  ECS-240-10-47Q-CES-TR  [XTAL_ECS-240-10-47Q-CES-TR]
Y3  ECS-.327-5-16-TR  [XTAL_ECS-.327-5-16-TR]

### Blocks framed on the sheet
GAP9 XTALs: C21 C22 C39 C40 GAP9 R37 Y2 Y3

### Ports
JTAG_NTRST (bidir), JTAG_TCK (bidir), JTAG_TDI (bidir), JTAG_TDO (bidir), JTAG_TMS (bidir), RESET_N (bidir)

### Nets
1V8_GAP: R37.2  [project net 1V8]
GND: C21.2 C22.2 C39.2 C40.2 Y2.2(GND)
FAST_XTAL_A: C39.1 GAP9.E1(FAST_XTAL_A) Y2.1(IN/OUT)
FAST_XTAL_B: C40.1 GAP9.F1(FAST_XTAL_B) Y2.3(OUT/IN)
JTAG_NTRST: GAP9.F2(JTAG_NTRST/GPIO85/USART4_RTS) ; port JTAG_NTRST  [project net GAP9_RST]
JTAG_TCK: GAP9.G4(JTAG_TCK/GPIO81/USART4_CLK) ; port JTAG_TCK
JTAG_TDI: GAP9.E2(JTAG_TDI/GPIO82/USART4_RX) ; port JTAG_TDI
JTAG_TDO: GAP9.F3(JTAG_TDO/GPIO83/USART4_TX) ; port JTAG_TDO
JTAG_TMS: GAP9.D1(JTAG_TMS/GPIO84/USART4_CTS) ; port JTAG_TMS
RESET_N: GAP9.D4(RESET_N) R37.1 ; port RESET_N
NetC21_1: C21.1 GAP9.C3(SLOW_XTAL_A) Y3.1
NetC22_1: C22.1 GAP9.C4(SLOW_XTAL_B) Y3.2

Not connected (* = marked no-connect by the designer): Y2 4(NC)

### Notes on the sheet
- Offsheet Connections
- 1
- 2
- 3
- 4
- 5
- 6
- 7
- 8
- A
- B
- C
- D
- Project:
- Date:
- Drawing number:
- Rev:
- Format:
- A3
- Drawn by:
- Laboratory:
- Page
- Sheet:
- of
- File:

### Library data of the parts
C21 C22 = CMP-06035-009792-1: Ceramic Capacitor 6pF ±0.05pF 100V X8G 0201 (0603 Metric)
C39 C40 = CBR02C200F5GAC: No Description Available; Mfr_Name: Kemet; Type: DEV; Copyright: Copyright (C) 2022 Ultra Librarian. All rights reserved.; Manufacturer_Part_Number: CBR02C200F5GAC; RefDes: RefDes
R37 = CMP-1010-00642-1: 100K 0.05W 1% 0201 (0603 Metric)  SMD; Case-EIA: 0201; Case-Metric: 0603; Technology: SMT; Power: 0.05 W; Tolerance: 1 %; value: 100k
Y2 = ECS-240-10-47Q-CES-TR: 24MHz Â±10ppm Crystal 10pF 150 Ohms 4-SMD, No Lead; MF: ECS Inc.; Value: *; SnapEDA_Link: https://www.snapeda.com/parts/ECS-240-10-47Q-CES-TR/ECS%20Inc./view-part/4221464/?ref=snap; Price: None; Availability: Unavailable; Package: SMD-4 ECS International; MP: ECS-240-10-47Q-CES-TR
Y3 = ECS-.327-5-16-TR: 32.768kHz Â±20ppm Crystal 9pF 90 kOhms 2-SMD, No Lead; MF: ECS Inc.; MP: ECS-.327-9-16-TR; Value: *; SnapEDA_Link: https://www.snapeda.com/parts/ECS-.327-9-16-TR/ECS%20Inc./view-part/620864/?ref=snap; DigiKey-Purchase-URL: https://snapeda.com/shop?store=DigiKey&id=620864; Package: SMD-2 ECS International; Digi-Key_Part_Number: XC2132CT-ND

## Sheet 04_GAP9_CHIP_MEM.SchDoc: GAP9Shield
size A3; DrawnBy: Hanna Müller and Victor Kartsch; Organization: Integrated Systems Laboratory; DocumentNumber: 4; Revision: v1.0; SheetNumber: 4; SheetTotal: 9
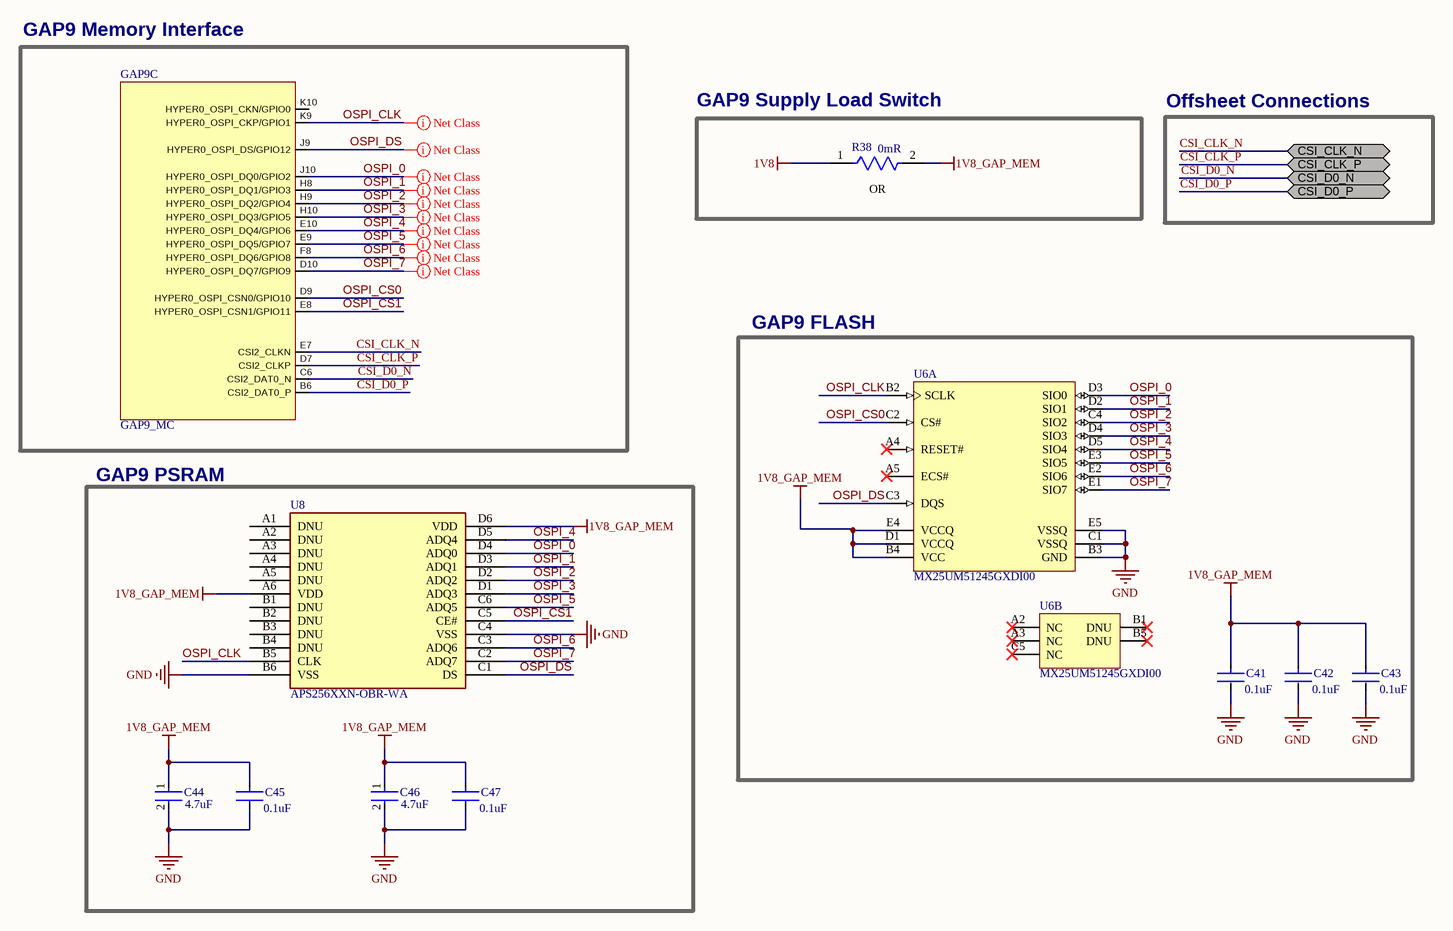
[diagram p3: 04_GAP9_CHIP_MEM.SchDoc]

### Parts
C41  Capacitance: 0.1uF  [FP-GRM033-0_03-IPC_B]  (hidden comment: GRM033Z71C104KE14D)
C42  Capacitance: 0.1uF  [FP-GRM033-0_03-IPC_B]  (hidden comment: GRM033Z71C104KE14D)
C43  Capacitance: 0.1uF  [FP-GRM033-0_03-IPC_B]  (hidden comment: GRM033Z71C104KE14D)
C44  Capacitance: 4.7uF  [FP-GRM035-0_09-IPC_B]  (hidden comment: GRM035R60J475ME15D)
C45  Capacitance: 0.1uF  [FP-GRM033-0_03-IPC_B]  (hidden comment: GRM033Z71C104KE14D)
C46  Capacitance: 4.7uF  [FP-GRM035-0_09-IPC_B]  (hidden comment: GRM035R60J475ME15D)
C47  Capacitance: 0.1uF  [FP-GRM033-0_03-IPC_B]  (hidden comment: GRM033Z71C104KE14D)
GAP9  GAP9_MC  [GAP9]  (part C of 5)
R38  value 0mR  [FP-CRCW0402-e3-IPC_C]  (hidden comment: CRCW04020000Z0ED)
U6  MX25UM51245GXDI00  [FBGA24_A-130]  (parts A,B of 2)
U8  APS256XXN-OBR-WA  [WLCSP24]

### Blocks framed on the sheet
GAP9 Memory Interface: GAP9
GAP9 Supply Load Switch: R38
GAP9 FLASH: C41-C43 U6
GAP9 PSRAM: C44-C47 U8

### Ports
CSI_CLK_N (bidir), CSI_CLK_P (bidir), CSI_D0_N (bidir), CSI_D0_P (bidir)

### Nets
1V8: R38.1
1V8_GAP_MEM: C41.1 C42.1 C43.1 C44.1 C45.1 C46.1 C47.1 R38.2 U6.B4(VCC) U6.D1(VCCQ) U6.E4(VCCQ) U8.A6(VDD) U8.D6(VDD)
GND: C41.2 C42.2 C43.2 C44.2 C45.2 C46.2 C47.2 U6.B3(GND) U6.C1(VSSQ) U6.E5(VSSQ) U8.B6(VSS) U8.C4(VSS)
CSI_CLK_N: GAP9.E7(CSI2_CLKN) ; port CSI_CLK_N  [project net CAM_CLK_N]
CSI_CLK_P: GAP9.D7(CSI2_CLKP) ; port CSI_CLK_P  [project net CAM_CLK_P]
CSI_D0_N: GAP9.C6(CSI2_DAT0_N) ; port CSI_D0_N  [project net CAM_D0_N]
CSI_D0_P: GAP9.B6(CSI2_DAT0_P) ; port CSI_D0_P  [project net CAM_D0_P]
OSPI_0: GAP9.J10(HYPER0_OSPI_DQ0/GPIO2) U6.D3(SIO0) U8.D4(ADQ0)
OSPI_1: GAP9.H8(HYPER0_OSPI_DQ1/GPIO3) U6.D2(SIO1) U8.D3(ADQ1)
OSPI_2: GAP9.H9(HYPER0_OSPI_DQ2/GPIO4) U6.C4(SIO2) U8.D2(ADQ2)
OSPI_3: GAP9.H10(HYPER0_OSPI_DQ3/GPIO5) U6.D4(SIO3) U8.D1(ADQ3)
OSPI_4: GAP9.E10(HYPER0_OSPI_DQ4/GPIO6) U6.D5(SIO4) U8.D5(ADQ4)
OSPI_5: GAP9.E9(HYPER0_OSPI_DQ5/GPIO7) U6.E3(SIO5) U8.C6(ADQ5)
OSPI_6: GAP9.F8(HYPER0_OSPI_DQ6/GPIO8) U6.E2(SIO6) U8.C3(ADQ6)
OSPI_7: GAP9.D10(HYPER0_OSPI_DQ7/GPIO9) U6.E1(SIO7) U8.C2(ADQ7)
OSPI_CLK: GAP9.K9(HYPER0_OSPI_CKP/GPIO1) U6.B2(SCLK) U8.B5(CLK)
OSPI_CS0: GAP9.D9(HYPER0_OSPI_CSN0/GPIO10) U6.C2(CS#)
OSPI_CS1: GAP9.E8(HYPER0_OSPI_CSN1/GPIO11) U8.C5(CE#)
OSPI_DS: GAP9.J9(HYPER0_OSPI_DS/GPIO12) U6.C3(DQS) U8.C1(DS)

Not connected (* = marked no-connect by the designer): GAP9 K10(HYPER0_OSPI_CKN/GPIO0); U6 A2(NC)* A3(NC)* A4(RESET#)* A5(ECS#)* B1(DNU)* B5(DNU)* C5(NC)*; U8 A1(DNU) A2(DNU) A3(DNU) A4(DNU) A5(DNU) B1(DNU) B2(DNU) B3(DNU) B4(DNU)

### Layout directives
net class MEMORIES: OSPI_0, OSPI_1, OSPI_2, OSPI_3, OSPI_4, OSPI_5, OSPI_6, OSPI_7, OSPI_CLK, OSPI_DS

### Notes on the sheet
- Offsheet Connections
- (near R38) OR
- 1
- 2
- 3
- 4
- 5
- 6
- 7
- 8
- A
- B
- C
- D
- Project:
- Date:
- Drawing number:
- Rev:
- Format:
- A3
- Drawn by:
- Laboratory:
- Page
- Sheet:
- of
- File:

### Library data of the parts
C41-C43 C45 C47 = CMP-06035-035508-1: as C25 on sheet 02_GAP9_CHIP_POWER; Case/Package: 0201
C44 C46 = CMP-06035-019701-1: Chip Multilayer Ceramic Capacitors for General Purpose, 0201, 4.7uF, X5R, 15%, 20%, 6.3V; Max Operating Temperature: 85°C; Packaging: Tape and Reel; Voltage Rating: 6.3V; Min Operating Temperature: -55°C; Case/Package: 0201; Voltage Rating (DC): 6.3V; Tolerance: 20%; Length: 0.024inch; Dielectric: X5R; Case Code (Imperial): 0201; Case Code (Metric): 0603; Width: 0.012inch; Mount: Surface Mount; Thickness: 0.022inch; value: 4.7uF
R38 = CMP-2002-08122-2: as R35 on sheet 01_GAP9_INTERFACE; Contact Plating: Tin; Height: 0.35mm; Radiation Hardening: No; Features: Automotive AEC-Q200; Composition: Thick Film; Width: 0.5mm; Weight: 2.3E-05oz; Termination: SMD/SMT; Packaging: Tape and Reel; Mount: Surface Mount; Case Code (Metric): 1005; Military Standard: Not; Min Operating Temperature: -55°C; Number of Terminations: 2; Package Quantity: 1; Case Code (Imperial): 0402; Depth: 0.5mm; Max Operating Temperature: 155°C; Case/Package: 0402; Resistance: 0mR; Power Rating: 63mW; Lead Free: Lead Free; Voltage Rating (DC): 50V; Length: 1mm
U6 = CMP-02792-1: NOR Flash Memory 512Mb 1.8V Octa I/O Serial 24-Pin BGA; Mfr: Macronix; Memory Type: Non-Volatile; Memory Size: 512Mbit; Memory Organization: 64M x 8; Memory Interface: SPI - Quad I/O, DTR; Clock Frequency: 200 MHz; Write Cycle Time - Word, Page: 60µs, 750µs; Voltage - Supply: 1.65V ~ 2V; Series: MXSMIO™; Digi-Key Programmable: Not Verified; Memory Format: FLASH; Technology: FLASH - NOR; Operating Temperature: -40°C ~ 85°C (TA); Mounting Type: Surface Mount; Package / Case: 24-TBGA; Supplier Device Package: 24-CSPBGA (6x8); Base Product Number: MX25UM51245
U8 = APS256XXN-OBR: No Description Available; Mfr_Name: AP Memory; Manufacturer_Part_Number: APS256XXN-OBR-BG; Copyright: Copyright (C) 2022 Ultra Librarian. All rights reserved.; RefDes: RefDes; Type: DEV

## Sheet 05_GAP9_CHIP_GPIO.SchDoc: GAP9Shield
size A3; DrawnBy: Hanna Müller and Victor Kartsch; Organization: Integrated Systems Laboratory; DocumentNumber: 5; Revision: v1.0; SheetNumber: 5; SheetTotal: 9
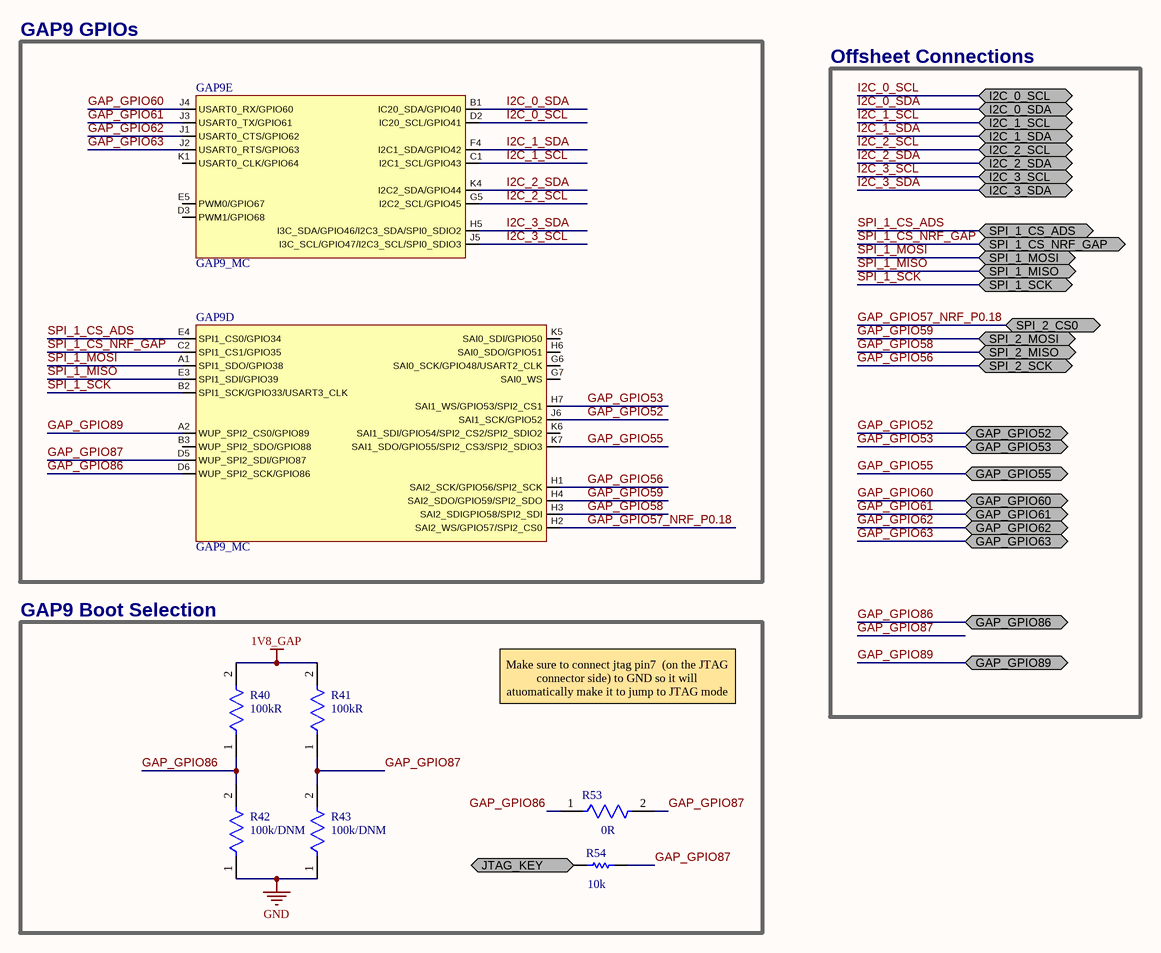
[diagram p4: 05_GAP9_CHIP_GPIO.SchDoc]

### Parts
GAP9  GAP9_MC  [GAP9]  (parts D,E of 5)
R40  value 100kR  [FP-ERJ1GN-IPC_A]  (hidden comment: ERJ-1GNF1003C)
R41  value 100kR  [FP-ERJ1GN-IPC_A]  (hidden comment: ERJ-1GNF1003C)
R42  value 100k/DNM  [FP-ERJ1GN-IPC_A]  (hidden comment: DNM)
R43  value 100k/DNM  [FP-ERJ1GN-IPC_A]  (hidden comment: DNM)
R53  value 0R  [FP-ERJ1GN-MFG]  (hidden comment: ERJ-1GN0R00C)
R54  value 10k  [RESC0603X28X15LL05T05]  (hidden comment: ERJ-U01F1001C)

### Blocks framed on the sheet
GAP9 GPIOs: GAP9
GAP9 Boot Selection: R40-R43 R53 R54

### Ports
GAP_GPIO52 (bidir), GAP_GPIO53 (bidir), GAP_GPIO55 (bidir), GAP_GPIO60 (bidir), GAP_GPIO61 (bidir), GAP_GPIO62 (bidir), GAP_GPIO63 (bidir), GAP_GPIO86 (bidir), GAP_GPIO89 (bidir), I2C_0_SCL (bidir), I2C_0_SDA (bidir), I2C_1_SCL (bidir), I2C_1_SDA (bidir), I2C_2_SCL (bidir), I2C_2_SDA (bidir), I2C_3_SCL (bidir), I2C_3_SDA (bidir), JTAG_KEY (bidir), SPI_1_CS_ADS (bidir), SPI_1_CS_NRF_GAP (bidir), SPI_1_MISO (bidir), SPI_1_MOSI (bidir), SPI_1_SCK (bidir), SPI_2_CS0 (bidir), SPI_2_MISO (bidir), SPI_2_MOSI (bidir), SPI_2_SCK (bidir)

### Nets
1V8_GAP: R40.2 R41.2  [project net 1V8]
GND: R42.1 R43.1
GAP_GPIO52: GAP9.J6(SAI1_SCK/GPIO52) ; port GAP_GPIO52
GAP_GPIO53: GAP9.H7(SAI1_WS/GPIO53/SPI2_CS1) ; port GAP_GPIO53
GAP_GPIO55: GAP9.K7(SAI1_SDO/GPIO55/SPI2_CS3/SPI2_SDIO3) ; port GAP_GPIO55
GAP_GPIO56: GAP9.H1(SAI2_SCK/GPIO56/SPI2_SCK) ; port SPI_2_SCK
GAP_GPIO57_NRF_P0.18: GAP9.H2(SAI2_WS/GPIO57/SPI2_CS0) ; port SPI_2_CS0
GAP_GPIO58: GAP9.H3(SAI2_SDIGPIO58/SPI2_SDI) ; port SPI_2_MISO
GAP_GPIO59: GAP9.H4(SAI2_SDO/GPIO59/SPI2_SDO) ; port SPI_2_MOSI
GAP_GPIO60: GAP9.J4(USART0_RX/GPIO60) ; port GAP_GPIO60
GAP_GPIO61: GAP9.J3(USART0_TX/GPIO61) ; port GAP_GPIO61
GAP_GPIO62: GAP9.J1(USART0_CTS/GPIO62) ; port GAP_GPIO62
GAP_GPIO63: GAP9.J2(USART0_RTS/GPIO63) ; port GAP_GPIO63
GAP_GPIO86: GAP9.D6(WUP_SPI2_SCK/GPIO86) R40.1 R42.2 R53.1 ; port GAP_GPIO86
GAP_GPIO87: GAP9.D5(WUP_SPI2_SDI/GPIO87) R41.1 R43.2 R53.2 R54.2
GAP_GPIO89: GAP9.A2(WUP_SPI2_CS0/GPIO89) ; port GAP_GPIO89
I2C_0_SCL: GAP9.D2(IC20_SCL/GPIO41) ; port I2C_0_SCL
I2C_0_SDA: GAP9.B1(IC20_SDA/GPIO40) ; port I2C_0_SDA
I2C_1_SCL: GAP9.C1(I2C1_SCL/GPIO43) ; port I2C_1_SCL
I2C_1_SDA: GAP9.F4(I2C1_SDA/GPIO42) ; port I2C_1_SDA
I2C_2_SCL: GAP9.G5(I2C2_SCL/GPIO45) ; port I2C_2_SCL
I2C_2_SDA: GAP9.K4(I2C2_SDA/GPIO44) ; port I2C_2_SDA
I2C_3_SCL: GAP9.J5(I3C_SCL/GPIO47/I2C3_SCL/SPI0_SDIO3) ; port I2C_3_SCL
I2C_3_SDA: GAP9.H5(I3C_SDA/GPIO46/I2C3_SDA/SPI0_SDIO2) ; port I2C_3_SDA
SPI_1_CS_ADS: GAP9.E4(SPI1_CS0/GPIO34) ; port SPI_1_CS_ADS
SPI_1_CS_NRF_GAP: GAP9.C2(SPI1_CS1/GPIO35) ; port SPI_1_CS_NRF_GAP
SPI_1_MISO: GAP9.E3(SPI1_SDI/GPIO39) ; port SPI_1_MISO
SPI_1_MOSI: GAP9.A1(SPI1_SDO/GPIO38) ; port SPI_1_MOSI
SPI_1_SCK: GAP9.B2(SPI1_SCK/GPIO33/USART3_CLK) ; port SPI_1_SCK
NetP3_7: R54.1 ; port JTAG_KEY

Not connected (* = marked no-connect by the designer): GAP9 B3(WUP_SPI2_SDO/GPIO88) D3(PWM1/GPIO68) E5(PWM0/GPIO67) G6(SAI0_SCK/GPIO48/USART2_CLK) G7(SAI0_WS) H6(SAI0_SDO/GPIO51) K1(USART0_CLK/GPIO64) K5(SAI0_SDI/GPIO50) K6(SAI1_SDI/GPIO54/SPI2_CS2/SPI2_SDIO2)

### Notes on the sheet
- Offsheet Connections
- Make sure to connect jtag pin7  (on the JTAG connector side) to GND so it will atuomatically make it to jump to JTAG mode
- 1
- 2
- 3
- 4
- 5
- 6
- 7
- 8
- A
- B
- C
- D
- Project:
- Date:
- Drawing number:
- Rev:
- Format:
- A3
- Drawn by:
- Laboratory:
- Page
- Sheet:
- of
- File:

### Library data of the parts
R40-R43 = CMP-2004-03446-2: RES SMD 100K OHM 1% 1/20W 0201; Temperature Coefficient: 200ppm/°C; Voltage Rating: 25V; Max Power Dissipation: 50mW; Packaging: Tape and Reel; Tolerance: 1%; Mount: Surface Mount; Case Code (Metric): 0603; Number of Terminations: 2; Contact Plating: Tin; Case Code (Imperial): 0201; Width: 0.012inch; Lead Free: Lead Free; Radiation Hardening: No; Termination: SMD/SMT; Weight: 6E-06oz; Height: 0.01inch; Max Operating Temperature: 125°C; Number of Pins: 2; REACH SVHC: No SVHC; Power Rating: 50mW; Voltage Rating (DC): 25V; Package Quantity: 15000; Case/Package: 0201; Min Operating Temperature: -55°C; Length: 0.024inch; Composition: Thick Film
  R40 R41: Resistance: 100kR
  R42 R43: Resistance: 100k/DNM
R53 = CMP-1010-00001-3: RES SMD 0 OHM JUMPER 1/20W 0201; Temperature Coefficient: 600ppm/°C; Max Power Dissipation: 50mW; Voltage Rating: 25V; Tolerance: 1%; Package Quantity: 15000; Case Code (Imperial): 0201; Number of Terminations: 2; Depth: 0.3mm; Lead Free: Lead Free; Military Standard: Not; Width: 0.3mm; Resistance: 0R; Series: ERJ; Max Operating Temperature: 125°C; Construction: Rectangular; Contact Plating: Tin; RoHS Compliant: Yes; Height: 0.23mm; Voltage Rating (DC): 25V; Mount: Surface Mount; Min Operating Temperature: -55°C; Power Rating: 50mW; Features: Automotive AEC-Q200; Resistor Type: Thick Film; Case/Package: 0201; Case Code (Metric): 0603; Length: 0.6mm; Packaging: Tape and Reel
R54 = CMP-2004-00016-1: Manufacturer: Vishay Dale; Part Number: CRCW020110K0FNED

## Sheet 06_TOFs.SchDoc: GAP9Shield
size A3; DrawnBy: Hanna Müller and Victor Kartsch; Organization: Integrated Systems Laboratory; DocumentNumber: 6; Revision: v1.0; SheetNumber: 6; SheetTotal: 9
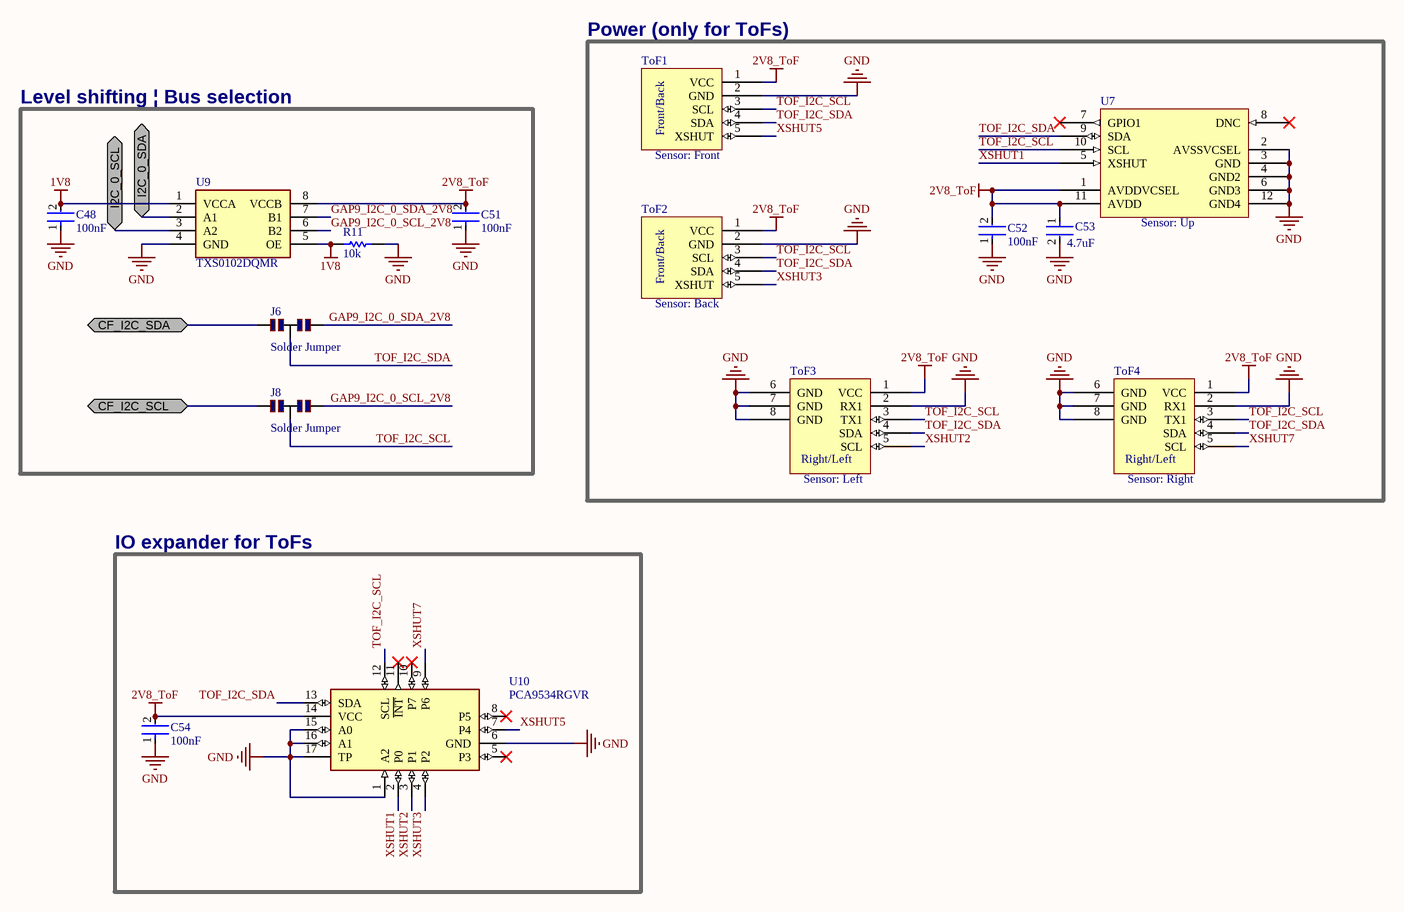
[diagram p5: 06_TOFs.SchDoc]

### Parts
C48  value 100nF  [FP-C1005-050-0_05-MFG]  (hidden comment: C1005X5R1E104K050BC)
C51  value 100nF  [FP-C1005-050-0_05-MFG]  (hidden comment: C1005X5R1E104K050BC)
C52  value 100nF  [FP-C1005-050-0_05-MFG]  (hidden comment: C1005X5R1E104K050BC)
C53  value 4.7uF  [FP-C1005-050-0_15-MFG]  (hidden comment: C1005X5R0J475K050BC)
C54  value 100nF  [FP-C1005-050-0_05-MFG]  (hidden comment: C1005X5R1E104K050BC)
J6  Solder Jumper  [Jumper 3 pins]  (no BOM)
J8  Solder Jumper  [Jumper 3 pins]  (no BOM)
R11  value 10k  [RESC0603X28X15LL05T05]  (hidden comment: CRCW020110K0FNED)
ToF1  (no value)  [ToF_Front_Back]
ToF2  (no value)  [ToF_Front_Back]
ToF3  (no value)  [ToF_Right_Left]
ToF4  (no value)  [ToF_Right_Left]
U7  VL53L1CXV0FY/1  [TOF]  (value not drawn)
U9  TXS0102DQMR  [SON40P120X180X40-8N]
U10  PCA9534RGVR  [QFN65P400X400X100-17N-D]

### Blocks framed on the sheet
Power (only for ToFs): C52 C53 ToF1-ToF4 U7
Level shifting | Bus selection: C48 C51 J6 J8 R11 U9
IO expander for ToFs: C54 U10

### Ports
CF_I2C_SCL (bidir), CF_I2C_SDA (bidir), I2C_0_SCL (bidir), I2C_0_SDA (bidir)

### Nets
1V8: C48.2 R11.2 U9.1(VCCA) U9.5(OE)
2V8_ToF: C51.2 C52.2 C53.1 C54.2 ToF1.1(VCC) ToF2.1(VCC) ToF3.1(VCC) ToF4.1(VCC) U7.1(AVDDVCSEL) U7.11(AVDD) U9.8(VCCB) U10.14(VCC)
GND: C48.1 C51.1 C52.1 C53.2 C54.1 R11.1 ToF1.2(GND) ToF2.2(GND) ToF3.2(RX1) ToF3.6(GND) ToF3.7(GND) ToF3.8(GND) ToF4.2(RX1) ToF4.6(GND) ToF4.7(GND) ToF4.8(GND) U7.2(AVSSVCSEL) U7.3(GND) U7.4(GND2) U7.6(GND3) U7.12(GND4) U9.4(GND) U10.1(A2) U10.6(GND) U10.15(A0) U10.16(A1) U10.17(TP)
GAP9_I2C_0_SCL_2V8: J8.3 U9.6(B2)
GAP9_I2C_0_SDA_2V8: J6.3 U9.7(B1)
I2C_0_SCL: U9.3(A2) ; port I2C_0_SCL
I2C_0_SDA: U9.2(A1) ; port I2C_0_SDA
TOF_I2C_SCL: J8.2 ToF1.3(SCL) ToF2.3(SCL) ToF3.3(TX1) ToF4.3(TX1) U7.10(SCL) U10.12(SCL)
TOF_I2C_SDA: J6.2 ToF1.4(SDA) ToF2.4(SDA) ToF3.4(SDA) ToF4.4(SDA) U7.9(SDA) U10.13(SDA)
XSHUT1: U7.5(XSHUT) U10.2(P0)
XSHUT2: ToF3.5(SCL) U10.3(P1)
XSHUT3: ToF2.5(XSHUT) U10.4(P2)
XSHUT5: ToF1.5(XSHUT) U10.7(P4)
XSHUT7: ToF4.5(SCL) U10.9(P6)
NetJ6_1: J6.1 ; port CF_I2C_SDA
NetJ8_1: J8.1 ; port CF_I2C_SCL

Not connected (* = marked no-connect by the designer): U7 7(GPIO1)* 8(DNC)*; U10 5(P3)* 8(P5)* 10(P7)* 11(~{INT})*

### Notes on the sheet
- (near ToF1) Sensor: Front
- (near U7) Sensor: Up
- (near ToF2) Sensor: Back
- (near ToF3) Sensor: Left
- (near ToF4) Sensor: Right
- 1
- 2
- 3
- 4
- 5
- 6
- 7
- 8
- A
- B
- C
- D
- Project:
- Date:
- Drawing number:
- Rev:
- Format:
- A3
- Drawn by:
- Laboratory:
- Page
- Sheet:
- of
- File:
- (in symbol ToF_Front_Back) Front/Back
- (in symbol ToF_Right_Letf) Right/Left

### Library data of the parts
C48 C51 C52 C54 = CMP-2000-06000-2: as C20 on sheet 01_GAP9_INTERFACE; Case Code (Imperial): 0402; Termination: Wraparound; Series: C; Depth: 0.5mm; Voltage Rating (DC): 25V; Contact Plating: Tin; Case Code (Metric): 1005; Dielectric: X5R; Case/Package: 0402; Voltage Rating: 25V; Packaging: Tape and Reel; Thickness: 0.022inch; Dielectric Material: Ceramic; Height: 0.5mm; Weight: 2.3E-05oz; RoHS Compliant: Yes; Width: 0.02inch; Capacitance: 100nF; Tolerance: 10%; Mount: Surface Mount; Package Quantity: 1; Max Operating Temperature: 85°C; Construction: Flat; Min Operating Temperature: -55°C; REACH SVHC: No SVHC; Resistor Type: Ceramic; Length: 1mm; Lead Free: Lead Free; Voltage: 25V
C53 = CMP-2000-05437-2: CAP CER 4.7UF 6.3V X5R 0402; Tolerance: 10%; Dielectric Material: Ceramic; Voltage: 6.3V; Capacitance: 4.7uF; Depth: 0.5mm; Height: 0.5mm; Length: 1mm; Termination: SMD/SMT; RoHS Compliant: Yes; Series: C; Case/Package: 0402; Dielectric: X5R; Lead Free: Lead Free; Mount: Surface Mount; Max Operating Temperature: 85°C; Min Operating Temperature: -55°C
J6 J8 = CMP-00467-5: Solder Jumper 3 Pads; Technology: SMT
R11 = CMP-2004-00016-1: Manufacturer: Vishay Dale; Part Number: CRCW020110K0FNED
ToF1 ToF2 = ToF_Front_Back: ToF PCBs (DNM); Supplier 1: Digi-Key; Supplier Part Number 1: 110990442-ND
ToF3 ToF4 = ToF_Right_Letf: Supplier 1: Digi-Key; Supplier Part Number 1: 110990442-ND
U7 = VL53L1X: Manufacturer: STMicroelectronics; Supplier 1: Digi-Key; Manufacturer Part Number: VL53L1CXV0FY/1; Stock 1: 5939; Pricing 1: 1 = 7.07000, 10 = 6.38600, 100 = 5.28660, 500 = 4.60350, 1000 = 4.00950 (USD); RoHS: No; ComponentLink1URL: http://www.farnell.com/datasheets/2600105.pdf?src-supplier=Farnell; ComponentLink1Description: http://www.farnell.com/datasheets/2600105.pdf?src-supplier=Farnell; ComponentLink2URL: http://www.st.com/content/ccc/resource/technical/document/datasheet/group3/7d/85/c8/95/fb/3b/4e/2d/DM00452094/files/DM00452094.pdf/jcr:content/translations/en.DM00452094.pdf?src-supplier=Digi-Key; ComponentLink2Description: http://www.st.com/content/ccc/resource/technical/document/datasheet/group3/7d/85/c8/95/fb/3b/4e/2d/DM00452094/files/DM00452094.pdf/jcr:content/translations/en.DM00452094.pdf?src-supplier=Digi-Key; Supplier Part Number 1: 497-17764-6-ND
U9 = TXS0102DQMR: Integrated Circuit; Manufacturer_Name: Texas Instruments; Datasheet Link: http://www.ti.com/lit/gpn/txs0102; Height: 0.4mm; Manufacturer_Part_Number: TXS0102DQMR; Mouser Part Number: 595-TXS0102DQMR; Mouser Price/Stock: https://www.mouser.co.uk/ProductDetail/Texas-Instruments/TXS0102DQMR?qs=l3GMcByk76LwJNFmr1RbWA%3D%3D; Arrow Part Number: TXS0102DQMR; Arrow Price/Stock: https://www.arrow.com/en/products/txs0102dqmr/texas-instruments?region=nac
U10 = PCA9534RGVR: Undefined or Miscellaneous; Manufacturer_Name: Texas Instruments; Datasheet Link: http://www.ti.com/lit/gpn/pca9534; Height: 1mm; Manufacturer_Part_Number: PCA9534RGVR; Mouser Part Number: 595-PCA9534RGVR; Mouser Price/Stock: https://www.mouser.co.uk/ProductDetail/Texas-Instruments/PCA9534RGVR?qs=iSMark9AYDX8ZzbjwCykBw%3D%3D; Arrow Part Number: PCA9534RGVR; Arrow Price/Stock: https://www.arrow.com/en/products/pca9534rgvr/texas-instruments